# EAGLE design MinieasySens-RFM_V03-Build004 (EAGLE 9.3.0)
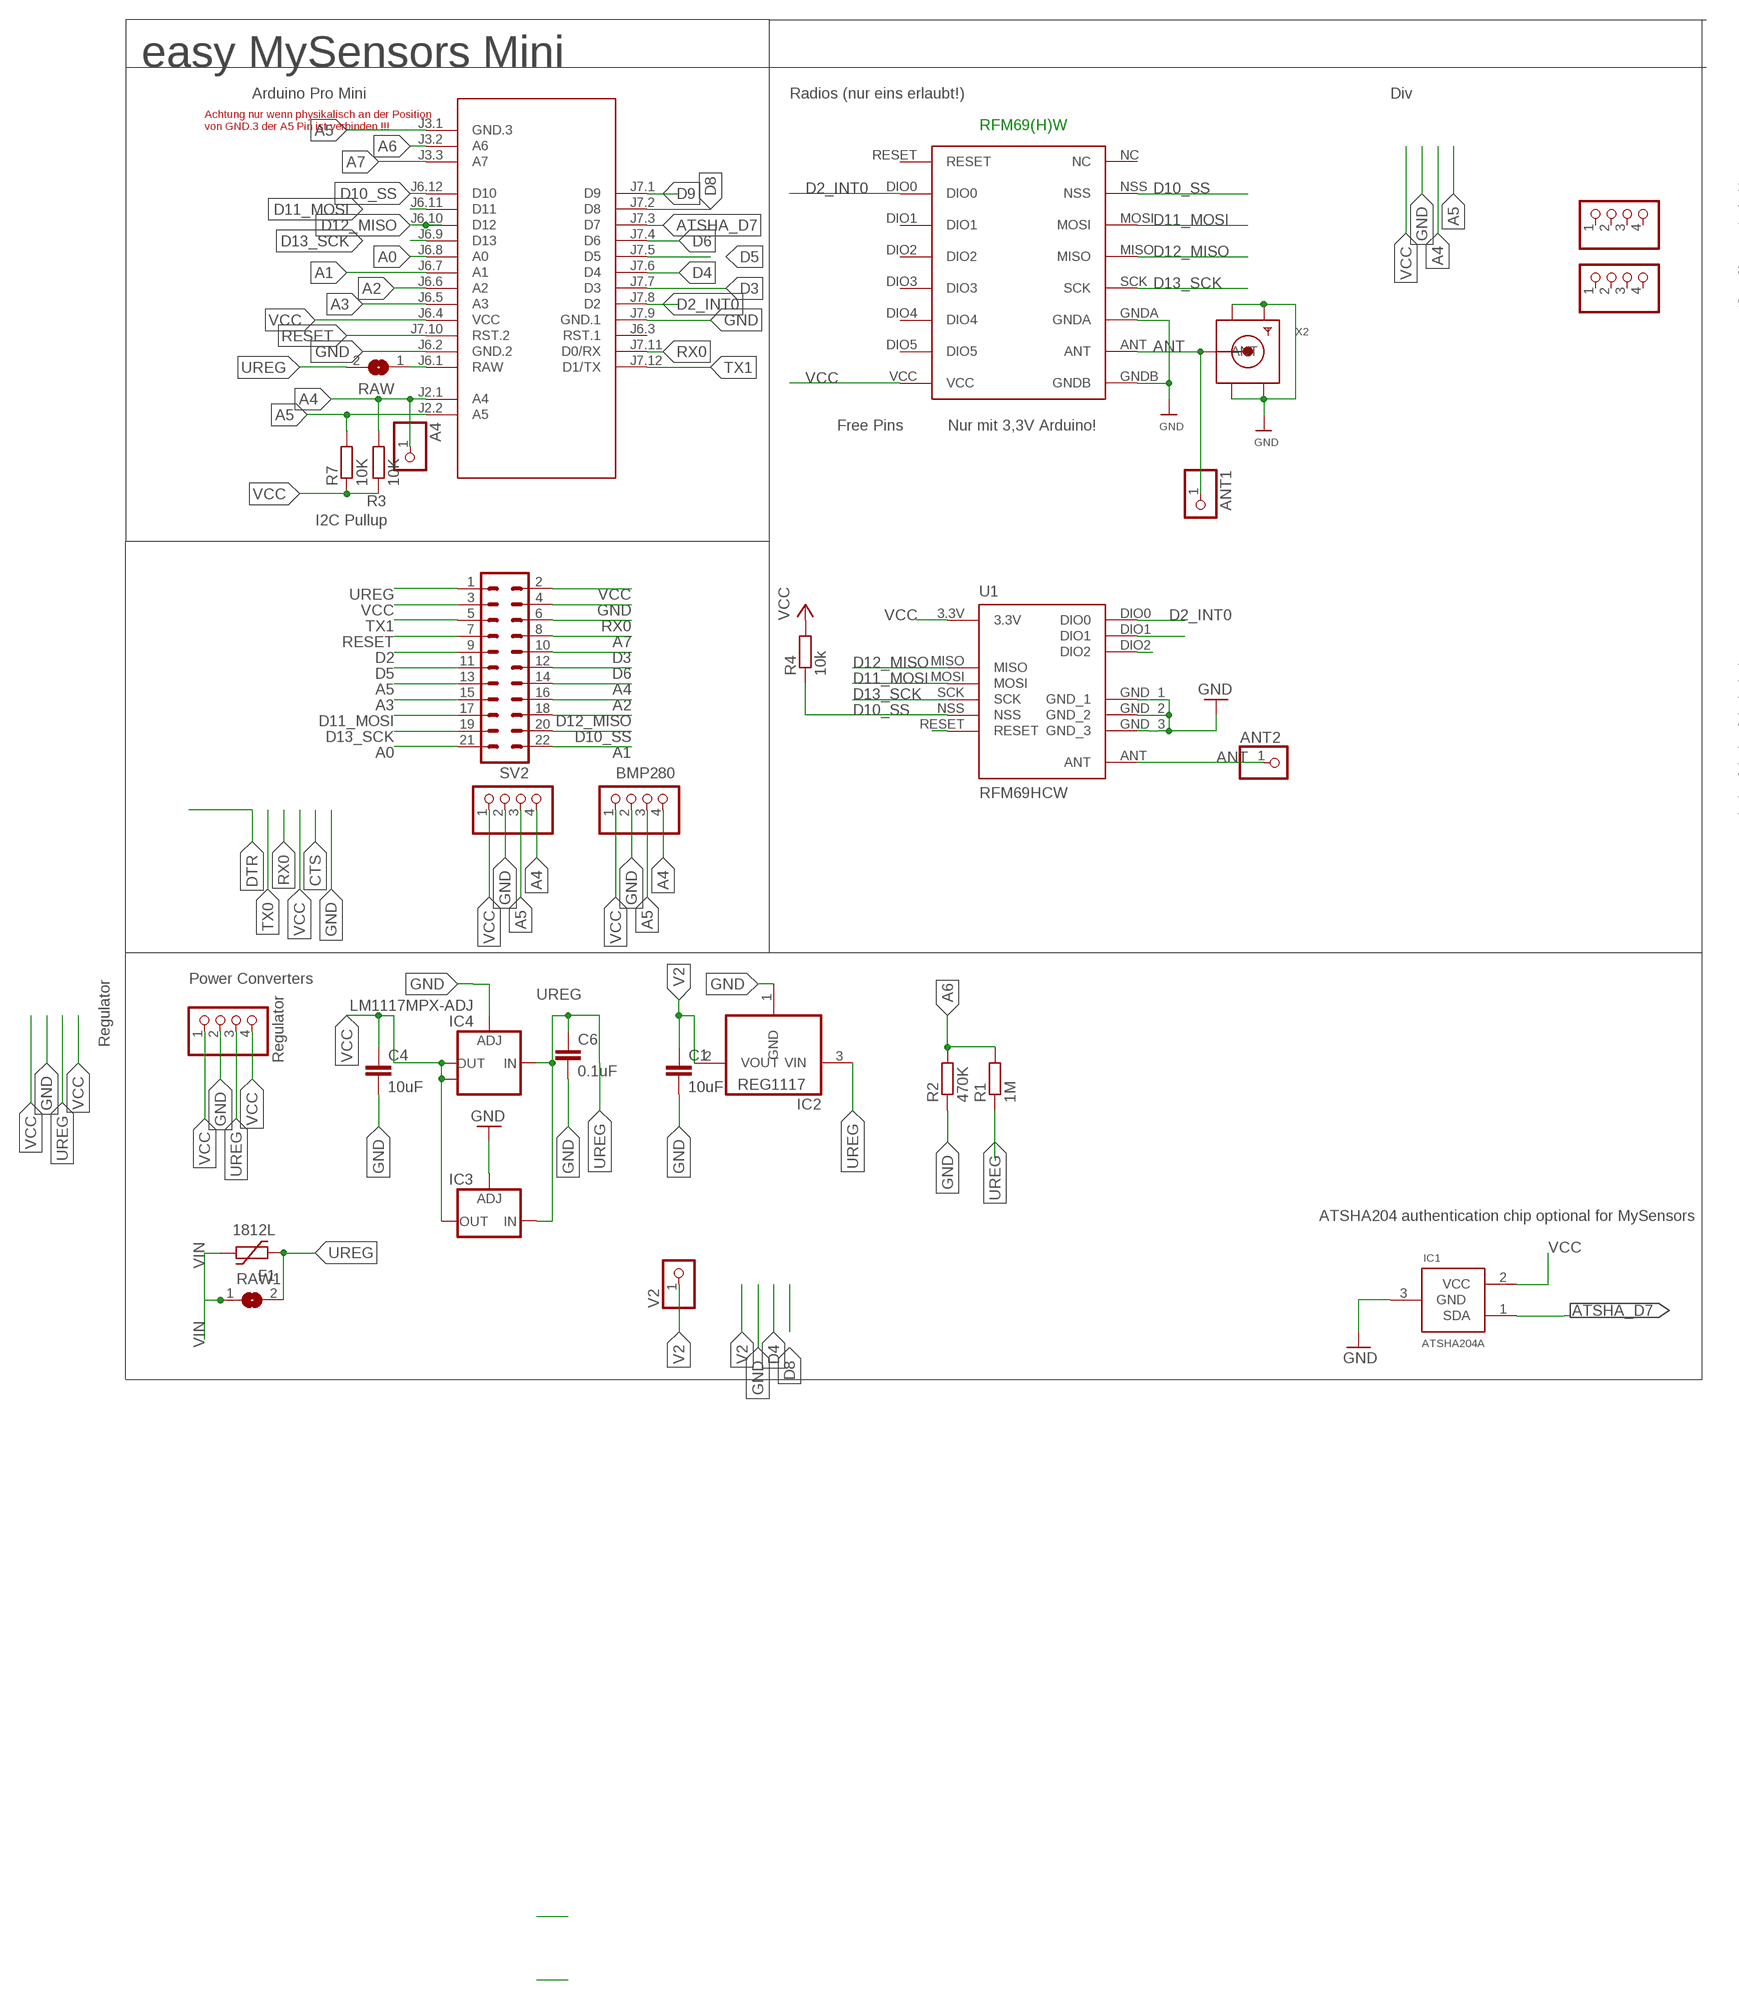
[diagram p0: schematic, sheet 1, part 1 of 2]
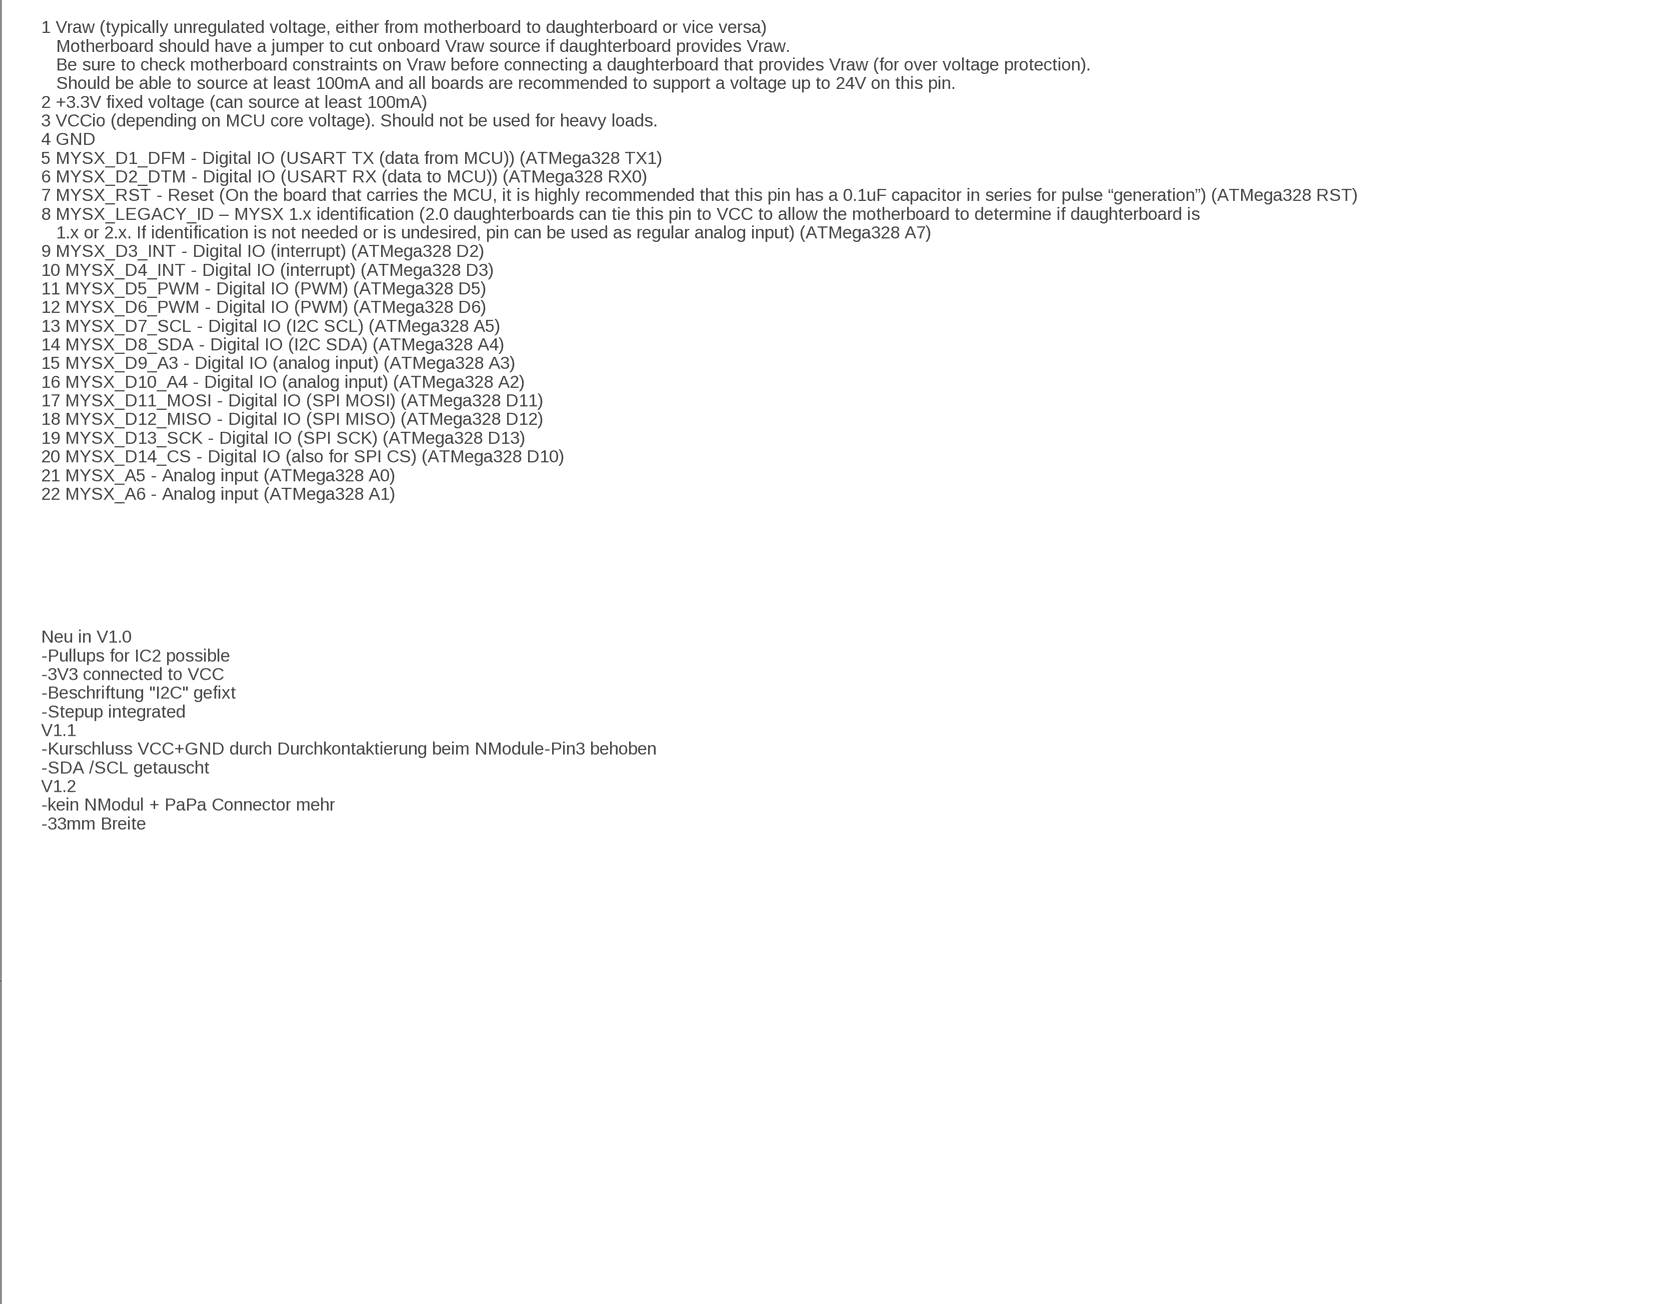
[diagram p1: schematic, sheet 1, part 2 of 2]

## Parts
A4  PINHD-1X1  [1X01]
ANT1  PINHD-1X1  [1X01]
ANT2  PINHD-1X1  [1X01]
BH1750  PINHD-1X04_2.54-S  [1X04-S]
C1  10uF  C-EUC1210  [C1210]
C4  10uF  C-EUC1210  [C1210]
C6  0.1uF  C-EUC1206  [C1206]
F1  1812L  [1812L]
I2C-1  PINHD-1X04_2.54-S  [1X04-S]
IC1  ATSHA204A  [SOT23]
IC2  REG1117  [SOT223]
IC3  LD117ADT50TR  [DPACK]
IC4  LM1117MPX-ADJ  [SOT223]
JP1  PINHD-1X04_2.54-S  [1X04-S]
JP2  PINHD-1X04_2.54-S  [1X04-S]
M1  ARDUINO-PRO-MINI-3.3V#NP  [ARDUINO-PRO-MINI#NP]
R1  1M  R-EU_R0805  [R0805]
R2  470K  R-EU_R0805  [R0805]
R3  10K  R-EU_R0805  [R0805]
R4  10k  R-EU_M0805  [M0805]
R7  10K  R-EU_R0805  [R0805]
RAW  SJ  [SJ]
RAW1  SJ  [SJ]
RFM69W  RFM69HW  [RFM]
STEPDWN  PINHD-1X04_2.54-S  [1X04-S]
SV2  MA11-2  [MA11-2]
U1  RFM69HCW  [RFM69HCW-XXXS2]
V2  PINHD-1X1  [1X01]
X2  SMACONNECTOR_EDGE  [SMA_EDGELAUNCH]

## Nets
A0: M1.J6.8(A0) SV2.21
A1: M1.J6.7(A1) SV2.22
A2: M1.J6.6(A2) SV2.16
A3: M1.J6.5(A3) SV2.15
A4: A4.1 BH1750.4 I2C-1.4 M1.J2.1(A4) R3.2 SV2.14
A5: BH1750.3 I2C-1.3 M1.J2.2(A5) M1.J3.1(GND.3) R7.2 SV2.13
A6: M1.J3.2(A6) R1.2 R2.2
A7: M1.J3.3(A7) SV2.8
ANT: ANT1.1 ANT2.1 RFM69W.ANT U1.ANT X2.P(ANT)
ATSHA_D7: IC1.1(SDA) M1.J7.3(D7)
D2: SV2.9
D2_INT0: M1.J7.8(D2) RFM69W.DIO0 U1.DIO0
D3: M1.J7.7(D3) SV2.10
D4: M1.J7.6(D4)
D5: M1.J7.5(D5) SV2.11
D6: M1.J7.4(D6) SV2.12
D8: M1.J7.2(D8)
D9: M1.J7.1(D9)
D10_SS: M1.J6.12(D10) R4.1 RFM69W.NSS SV2.20 U1.NSS
D11_MOSI: M1.J6.11(D11) RFM69W.MOSI SV2.17 U1.MOSI
D12_MISO: M1.J6.10(D12) RFM69W.MISO SV2.18 U1.MISO
D13_SCK: M1.J6.9(D13) RFM69W.SCK SV2.19 U1.SCK
GND [PWR]: BH1750.2 C1.2 C4.2 C6.2 I2C-1.2 IC1.3(GND) IC2.1(GND) IC3.1(ADJ) IC4.1(ADJ) M1.J6.2(GND.2) M1.J7.9(GND.1) R2.1 RFM69W.GNDA RFM69W.GNDB STEPDWN.2 SV2.4 U1.GND_1 U1.GND_2 U1.GND_3 X2.GND@1(GND4) X2.GND@2(GND3) X2.GND@3(GND2) X2.GND@4(GND1)
N$3: U1.RESET
N$14: U1.DIO2
N$15: U1.DIO1
RAW [PWR]: M1.J6.1(RAW) RAW.1
RESET: M1.J7.10(RST.2) SV2.7
RX0: M1.J7.11(D0/RX) SV2.6
TX1: M1.J7.12(D1/TX) SV2.5
UREG [PWR]: C6.1 F1.P$1 IC2.3(VIN) IC3.3(IN) IC4.3(IN) R1.1 RAW1.2 RAW.2 STEPDWN.3 SV2.1
V2 [PWR]: C1.1 IC2.2(VOUT) V2.1
VCC [PWR]: BH1750.1 C4.1 I2C-1.1 IC1.2(VCC) IC3.4(OUT) IC4.2(OUT) IC4.TAB(OUT1) M1.J6.4(VCC) R3.1 R4.2 R7.1 RFM69W.VCC STEPDWN.1 STEPDWN.4 SV2.2 SV2.3 U1.3.3V
VIN [PWR]: F1.P$2 RAW1.1
Unconnected: JP1.1 JP1.2 JP1.3 JP1.4 JP2.1 JP2.2 JP2.3 JP2.4 M1.J6.3(RST.1) RFM69W.DIO1 RFM69W.DIO2 RFM69W.DIO3 RFM69W.DIO4 RFM69W.DIO5 RFM69W.NC RFM69W.RESET

## Notes on the sheet
- easy MySensors Mini
- Arduino Pro Mini | Radios (nur eins erlaubt!) | Div
- Achtung nur wenn physikalisch an der Position 
  von GND.3 der A5 Pin ist verbinden !!!
- RFM69(H)W
- Free Pins | Nur mit 3,3V Arduino!
- I2C Pullup
- 1 Vraw (typically unregulated voltage, either from motherboard to daughterboard or vice versa)
     Motherboard should have a jumper to cut onboard Vraw source if daughterboard provides Vraw. 
     Be sure to check motherboard constraints on Vraw before connecting a daughterboard that provides Vraw (for over voltage protection). 
     Should be able to source at least 100mA and all boards are recommended to support a voltage up to 24V on this pin.
  2 +3.3V fixed voltage (can source at least 100mA)
  3 VCCio (depending on MCU core voltage). Should not be used for heavy loads.
  4 GND
  5 MYSX_D1_DFM - Digital IO (USART TX (data from MCU)) (ATMega328 TX1)
  6 MYSX_D2_DTM - Digital IO (USART RX (data to MCU)) (ATMega328 RX0)
  7 MYSX_RST - Reset (On the board that carries the MCU, it is highly recommended that this pin has a 0.1uF capacitor in series for pulse “generation”) (ATMega328 RST)
  8 MYSX_LEGACY_ID – MYSX 1.x identification (2.0 daughterboards can tie this pin to VCC to allow the motherboard to determine if daughterboard is 
     1.x or 2.x. If identification is not needed or is undesired, pin can be used as regular analog input) (ATMega328 A7)
  9 MYSX_D3_INT - Digital IO (interrupt) (ATMega328 D2)
  10 MYSX_D4_INT - Digital IO (interrupt) (ATMega328 D3)
  11 MYSX_D5_PWM - Digital IO (PWM) (ATMega328 D5)
  12 MYSX_D6_PWM - Digital IO (PWM) (ATMega328 D6)
  13 MYSX_D7_SCL - Digital IO (I2C SCL) (ATMega328 A5)
  14 MYSX_D8_SDA - Digital IO (I2C SDA) (ATMega328 A4)
  15 MYSX_D9_A3 - Digital IO (analog input) (ATMega328 A3)
  16 MYSX_D10_A4 - Digital IO (analog input) (ATMega328 A2)
  17 MYSX_D11_MOSI - Digital IO (SPI MOSI) (ATMega328 D11)
  18 MYSX_D12_MISO - Digital IO (SPI MISO) (ATMega328 D12)
  19 MYSX_D13_SCK - Digital IO (SPI SCK) (ATMega328 D13)
  20 MYSX_D14_CS - Digital IO (also for SPI CS) (ATMega328 D10)
  21 MYSX_A5 - Analog input (ATMega328 A0)
  22 MYSX_A6 - Analog input (ATMega328 A1)
- BMP280
- Neu in V1.0
  -Pullups for IC2 possible
  -3V3 connected to VCC
  -Beschriftung "I2C" gefixt
  -Stepup integrated
  V1.1
  -Kurschluss VCC+GND durch Durchkontaktierung beim NModule-Pin3 behoben
  -SDA /SCL getauscht
  V1.2
  -kein NModul + PaPa Connector mehr
  -33mm Breite
- Power Converters
- Regulator
- Regulator
- ATSHA204 authentication chip optional for MySensors

## Library data of the parts
A4 ANT1 ANT2 V2 = pinhead:PINHD-1X1: PIN HEADER
BH1750 I2C-1 JP1 JP2 STEPDWN = pinhead-2:PINHD-1X04: PIN HEADER
C1 C4 C6 = rcl:C-EU: CAPACITOR, European symbol
F1 = ptc-littlefuse:1812L
IC1 = Sensor:ATSHA204A
IC2 = burr-brown:REG1117: 800mA and 1A Low Dropout (LDO) Positive Regulator 1.8V, 2.5V, 2.85V, 3.3V, 5V, and Adj; MPN: REG1117; OC_FARNELL: 1097566; OC_NEWARK: 14P6981
IC3 = v-reg:LD117A?*: Low drop fixed and adjustable positive voltage regulators 1 A Source: http://www.st.com/stonline/products/literature/ds/7194/ld1117axx.pdf
IC4 = lm1117:LM1117MPX-ADJ
M1 = diy-modules:ARDUINO-PRO-MINI-*#NP: Arduino Pro Mini without programming pads
R1-R4 R7 = rcl:R-EU_: RESISTOR, European symbol
RAW RAW1 = jumper:SJ: SMD solder JUMPER
RFM69W = hoperf:RFM69HW
SV2 = con-Pinheader:MA11-2: PIN HEADER; OC_FARNELL: unknown; OC_NEWARK: unknown
U1 = doug:RFM69H
X2 = adafruit:SMACONNECTOR: SMA Connector 90° DIP SMA Connector, 50 Ohm (4UConnector: 07259)

## Net classes
0 default: width 0.254 mm, clearance 0.205 mm
1 PWR: width 0.406 mm, clearance 0.205 mm to class 0, clearance 0.205 mm

## Board
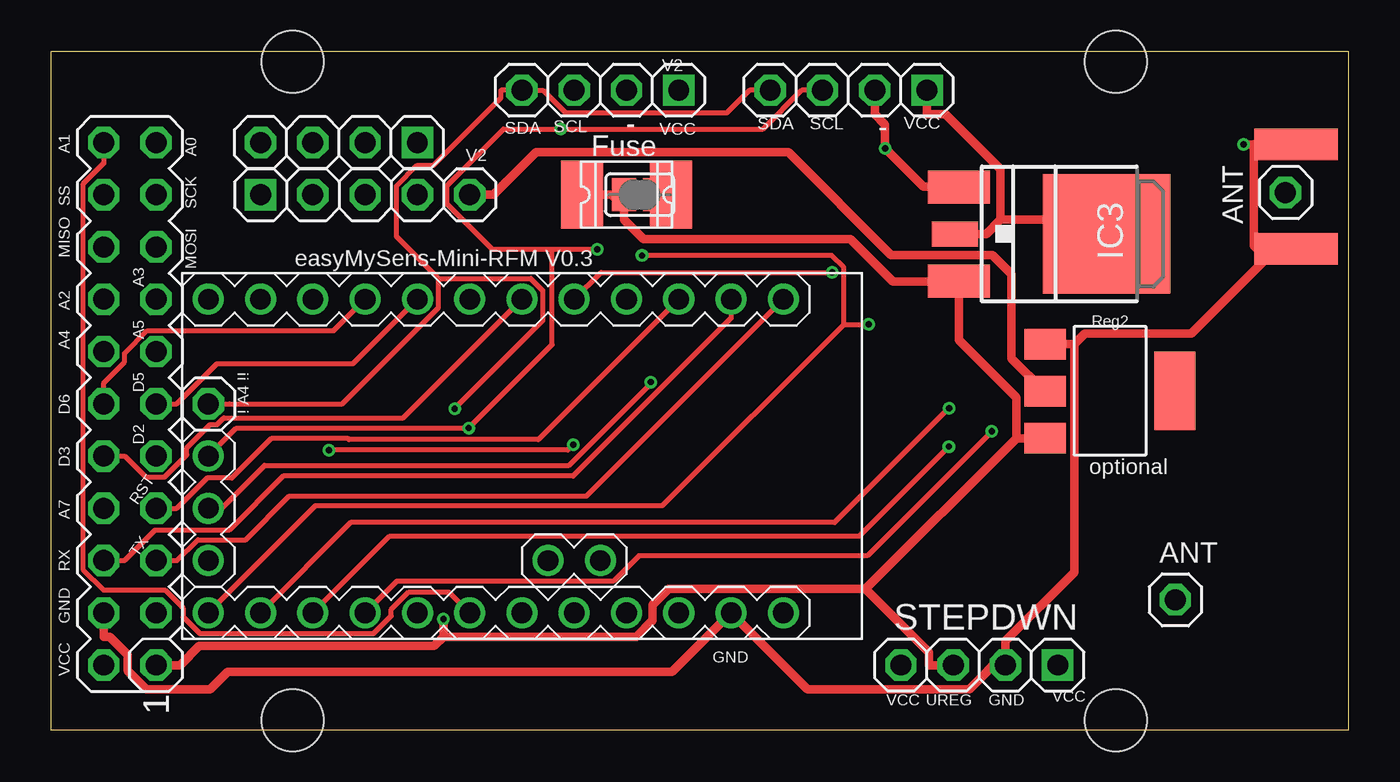
[diagram p2: board, top side]
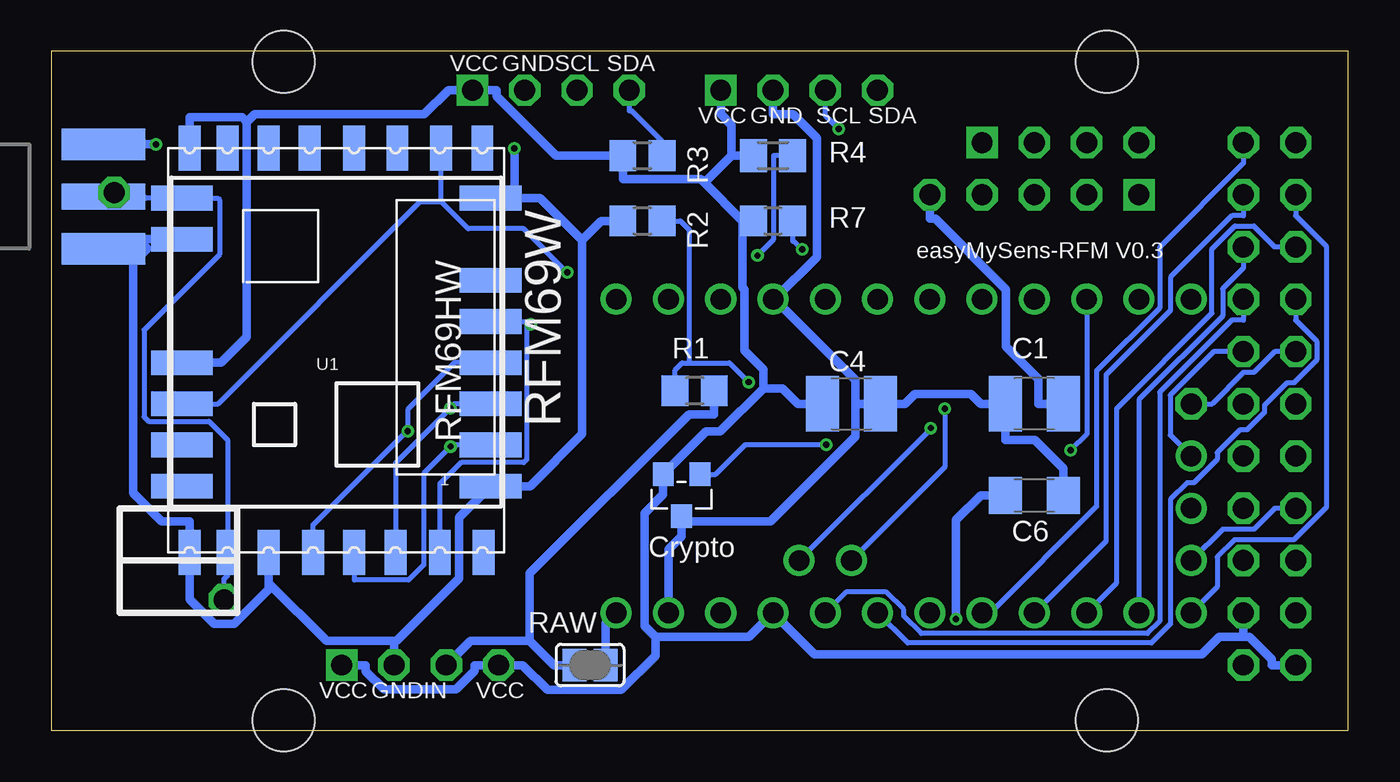
[diagram p3: board, bottom side, seen from below]

Size 63 x 33 mm. Coordinates in mm from the lower left corner, seen from the top.
Outline: 63,0 0,0 0,33 63,33 63,0
Copper layers (1*16): Top 0.035mm / dielectric 1.5mm / Bottom 0.035mm
Design rules "dirt_cheap_dirty_boards.v1": minimum track width 5mil, minimum drill 12mil, track to track 5mil, track to pad 5mil, pad to pad 5mil, via to via 5mil, smd to smd 0mil, copper to edge 10mil, drill to drill 10mil, minimum pad ring 10mil, minimum via ring 6mil, stop-mask expansion 2mil, vias tented up to drill 25mil, thermal gap 10mil
Holes 3 mm at 11.72,32.5 11.72,0.5 51.72,32.5 51.72,0.5
tRestrict: area 3.8,32.4 to 62.9,33; area 4.4,0 to 62.9,1.3
bRestrict: area 3.8,32.4 to 62.9,33; area 4.4,0 to 62.9,1.3

### Footprints (pad centres in the part's own frame; a part is rotated, then mirrored left to right if it is on the bottom)
1X01 = drill 1.016 octagon: 1 0,0
1X04-S = drill 1.016 square: 1 -3.81,0 | drill 1.016 octagon: 2 -1.27,0; 3 1.27,0; 4 3.81,0
C1210 = smd 1.6 x 2.7: 1 -1.4,0; 2 1.4,0
C1206 = smd 1.6 x 1.8: 1 -1.4,0; 2 1.4,0
1812L = smd 2.03 x 3.3: P$1 -2.16,0; P$2 2.16,0
SOT23 = smd 1.016 x 1.143: 1 -0.889,-1.016; 2 0.889,-1.016; 3 0,1.016
SOT223 = smd 1.499 x 2.007: 1 -2.261,-3.15; 2 0.025,-3.15; 3 2.311,-3.15 | smd 3.81 x 2.007: 4 0,3.15
DPACK = smd 1.6 x 3: 1 -2.28,-4.8; 3 2.28,-4.8 | smd 5.8 x 6.2: 4 0,2.38
SOT223' = smd 1.219 x 2.235: 1 -2.311,-3.099; 2 0,-3.099; 3 2.311,-3.099 | smd 3.6 x 2.2: TAB 0,3.099
ARDUINO-PRO-MINI#NP = drill 1: J2.1 -1.27,5.08; J2.2 -3.81,5.08; J3.1 15.24,0; J3.2 15.24,2.54; J3.3 15.24,5.08; J6.1 -12.7,7.62; J6.2 -10.16,7.62; J6.3 -7.62,7.62; J6.4 -5.08,7.62; J6.5 -2.54,7.62; J6.6 0,7.62; J6.7 2.54,7.62; J6.8 5.08,7.62; J6.9 7.62,7.62; J6.10 10.16,7.62; J6.11 12.7,7.62; J6.12 15.24,7.62; J7.1 15.24,-7.62; J7.2 12.7,-7.62; J7.3 10.16,-7.62; J7.4 7.62,-7.62; J7.5 5.08,-7.62; J7.6 2.54,-7.62; J7.7 0,-7.62; J7.8 -2.54,-7.62; J7.9 -5.08,-7.62; J7.10 -7.62,-7.62; J7.11 -10.16,-7.62; J7.12 -12.7,-7.62
R0805 = smd 1.3 x 1.5: 1 -0.95,0; 2 0.95,0
M0805 = smd 1.3 x 1.6: 1 -0.95,0; 2 0.95,0
SJ = smd 1.168 x 1.6: 1 -0.762,0; 2 0.762,0
RFM = smd 2.184 x 1.067: ANT 19.651,2.889; DIO0 0,13.27; DIO1 0,11.143; DIO2 0,9.047; DIO3 0,6.889; DIO4 0,4.889; DIO5 0,2.889; GNDA 19.651,4.889; GNDB 19.651,1.048; MISO 19.651,9.047; MOSI 19.651,11.047; NC 19.651,15.334; NSS 19.651,13.206; RESET 0,15.27; SCK 19.651,7.048; VCC 0,1.048
MA11-2 = drill 1.016 octagon: 1 -12.7,-1.27; 2 -12.7,1.27; 3 -10.16,-1.27; 4 -10.16,1.27; 5 -7.62,-1.27; 6 -7.62,1.27; 7 -5.08,-1.27; 8 -5.08,1.27; 9 -2.54,-1.27; 10 -2.54,1.27; 11 0,-1.27; 12 0,1.27; 13 2.54,-1.27; 14 2.54,1.27; 15 5.08,-1.27; 16 5.08,1.27; 17 7.62,-1.27; 18 7.62,1.27; 19 10.16,-1.27; 20 10.16,1.27; 21 12.7,-1.27; 22 12.7,1.27
RFM69HCW-XXXS2 = smd 3 x 1.2: 3.3V 7.5,1; ANT 7.5,-7; DIO0 7.5,3; DIO1 7.5,5; DIO2 7.5,7; GND_1 7.5,-5; GND_2 -7.5,-7; GND_3 -7.5,7; MISO -7.5,5; MOSI -7.5,3; NSS -7.5,-1; RESET -7.5,-3; SCK -7.5,1
SMA_EDGELAUNCH = smd 4.064 x 1.524: GND@1 2.032,-2.54; GND@2 2.032,2.54 | smd 4.064 x 1.524 bottom: GND@3 2.032,2.54; GND@4 2.032,-2.54 | smd 4.064 x 1.27: P 2.032,0

### Placement (x,y rotation side)
A4  7.62,15.88 90 top
ANT1  59.96,26.14 0 top
ANT2  54.61,6.35 0 top
BH1750  38.73,31.11 180 top
C1  15.24,15.88 180 bottom
C4  24.13,15.88 0 bottom
C6  15.24,11.43 0 bottom
F1  27.94,26.04 0 top
I2C-1  26.67,31.11 180 top
IC1  32.38,11.43 180 bottom
IC2  51.44,16.51 270 top
IC3  48.9,24.13 270 top
IC4  LM1117MPX-ADJ  [SOT223']  46.99,24.13 270 top
JP1  13.97,26.04 0 top
JP2  13.97,28.57 180 top
M1  22.86,13.34 180 top
R1  31.75,16.51 180 bottom
R2  34.29,24.77 0 bottom
R3  34.29,27.94 0 bottom
R4  27.94,27.94 180 bottom
R7  27.94,24.77 0 bottom
RAW  36.83,3.17 180 bottom
RAW1  28.57,26.04 180 top
RFM69W  57.34,28.3 270 bottom
STEPDWN  45.09,3.17 180 top
SV2  3.81,15.88 90 top
U1  49.16,18.87 180 bottom
V2  20.32,26.04 0 top
X2  62.5,25.95 0 bottom

### Tracks (layer width: path | path; a pad name or v marks a point on that pad's centre or on a via)
A0
  Bottom 0.254: SV2.21 5.08,27.56 9.15,23.49 9.15,20.54 12.22,17.47 12.22,10.88 17.39,5.71 M1.J6.8
A1
  Top 0.254: SV2.22 2.54,27.56 1.52,26.54 1.52,7.83 2.53,6.82 5.53,6.82 6.39,5.95 6.39,5.51 7.2,4.71 15.66,4.71 16.51,5.56 16.51,5.87 17.36,6.73 19.31,6.73 M1.J6.7
A2
  Bottom 0.254: SV2.16 2.54,19.94 1.52,18.92 1.52,17.99 2.63,16.89 2.97,16.89 4.06,15.79 4.06,15.45 4.91,14.61 5.25,14.61 6.35,13.5 6.35,13.17 7.49,12.04 7.81,12.04 8.63,11.22 8.63,5.17 9.55,4.25 21.39,4.25 M1.J6.6
A3
  Bottom 0.254: M1.J6.5 24.39,6.73 22.44,6.73 21.59,5.88 21.59,5.56 20.74,4.71 9.74,4.71 9.15,5.3 9.15,16.44 5.65,19.94 5.08,19.94 SV2.15
A4  (via drill 0.3 pad 0.61)
  Top 0.254: 18.8,21.96 16.76,24.01 16.76,26.46 17.77,27.47 18.57,27.47 21.84,30.75 21.84,31.11 I2C-1.4 23.88,31.11 24.97,30.02 32.81,30.02 33.91,31.11 BH1750.4 | 18.8,21.96 18.8,20.55 14.13,15.88 8.64,15.88 A4.1 | 18.8,21.96 23.28,21.96 23.87,21.38 23.87,19.92 v19.59,15.64
  Bottom 0.254: v19.59,15.64 19.59,12.79 M1.J2.1 | A4.1 6.6,15.88 5.08,17.4 4.57,17.4 3.56,18.41 SV2.14 | BH1750.4 34.92,30.1 34.79,30.1 33.34,28.65 R3.2
A5  (via drill 0.3 pad 0.61)
  Top 0.254: 24.33,23.38 24.33,18.75 v20.27,14.7 8.98,14.7 M1.J3.1 | 24.33,23.38 21.43,23.38 19.22,25.58 19.22,26.49 21.96,29.23 v24.75,29.23 34.56,29.23 36.45,31.11 BH1750.3 | v26.52,23.38 24.33,23.38
  Bottom 0.254: M1.J2.2 20.27,14.65 v20.27,14.7 | SV2.13 6.52,18.41 8.64,16.3 8.64,14.35 M1.J3.1 | R7.2 26.99,23.76 26.91,23.76 v26.52,23.38 | v24.75,29.23 25.4,29.88 I2C-1.3
A6  (via drill 0.3 pad 0.61)
  Top 0.254: M1.J3.2 8.27,10.79 10.36,12.88 25.14,12.88 29.13,16.87 v29.13,16.93
  Bottom 0.254: 32.01,17.86 30.06,17.86 v29.13,16.93 | 32.01,17.86 32.36,17.86 32.7,17.51 R1.2 | 32.01,17.86 32.01,24.34 32.44,24.77 R2.2
A7
  Bottom 0.254: SV2.8 3.56,10.79 4.57,9.78 6.1,9.78 M1.J3.3
ANT
  Bottom 0.254: ANT2.1 54.61,7.37 54.45,7.53 RFM69W.ANT 54.45,14.12 55.34,15.02 58.27,15.02 58.5,15.24 58.5,19.46 54.83,23.13 54.83,25.79 54.91,25.87 U1.ANT 57.54,25.87 58.42,25.87 58.64,26.09 59.96,26.09 | X2.P 60.1,25.95 59.96,26.09 | 59.96,26.09 ANT1.1
ATSHA_D7  (via drill 0.3 pad 0.61)
  Top 0.254: v25.35,13.88 25.09,13.62 v13.48,13.62
  Bottom 0.254: M1.J7.3 12.7,14.39 v13.48,13.62 | IC1.1 30.73,12.45 29.3,13.88 v25.35,13.88
D2_INT0  (via drill 0.3 pad 0.61)
  Top 0.254: M1.J7.8 26.71,22.26 v37.94,22.26
  Bottom 0.254: 44.06,25.7 RFM69W.DIO0 | v37.94,22.26 40.06,24.38 42.75,24.38 44.06,25.7 | 44.06,25.7 45.09,25.7 54.91,15.87 U1.DIO0
D3
  Top 0.254: M1.J7.7 17.09,15.19 8.37,15.19 8.04,14.86 7.71,14.86 6.57,13.72 6.57,13.39 5.5,12.31 4.58,12.31 3.56,13.34 SV2.10
D5
  Top 0.254: M1.J7.5 14.63,17.81 8.03,17.81 6.1,15.88 SV2.11
D6
  Top 0.254: SV2.12 2.54,16.89 3.56,17.91 3.56,18.33 4.66,19.43 13.72,19.43 M1.J7.4
D10_SS  (via drill 0.3 pad 0.61)
  Top 0.254: 38.5,19.74 v39.71,19.74 | 38.5,19.74 38.5,22.5 37.91,23.08 v28.7,23.08 | M1.J6.12 12.83,10.93 29.69,10.93 38.5,19.74
  Bottom 0.254: 39.91,19.74 v39.71,19.74 | 39.91,19.74 39.91,13.16 40.05,13.02 43.09,13.02 44.13,11.98 RFM69W.NSS | 39.91,19.74 39.91,19.87 U1.NSS | M1.J6.12 6.35,6.98 6.35,8.42 5.5,9.27 2.63,9.27 1.06,10.83 1.06,23.54 2.54,25.02 SV2.20 | v28.7,23.08 27.89,23.88 27.89,27.94 R4.1
D11_MOSI  (via drill 0.3 pad 0.61)
  Top 0.254: v43.61,15.66 38.05,10.1 14.54,10.1 | 14.54,10.1 | 14.54,10.1 M1.J6.11
  Bottom 0.254: SV2.17 5.08,22.48 6.1,21.46 6.1,20.14 10.16,16.08 M1.J6.11 | RFM69W.MOSI 46.29,12.99 v43.61,15.66 43.42,15.86 43.42,15.87 U1.MOSI
D12_MISO  (via drill 0.3 pad 0.61)
  Top 0.254: M1.J6.10 16.43,9.45 39.26,9.45 v43.61,13.8
  Bottom 0.254: U1.MISO 43.42,13.87 43.49,13.8 v43.61,13.8 44.92,12.49 44.92,8.04 45.65,7.31 48.29,7.31 RFM69W.MISO | M1.J6.10 11.24,7.17 11.24,15.64 6.61,20.27 6.61,23.4 5.5,24.52 4.58,24.52 3.56,23.5 SV2.18
D13_SCK  (via drill 0.3 pad 0.61)
  Top 0.254: v45.69,14.54 39.64,8.49 28.54,8.49 27.3,7.25 16.77,7.25 M1.J6.9
  Bottom 0.254: M1.J6.9 11.76,9.2 11.76,17.28 8.63,20.41 8.63,22.03 5.64,25.02 5.08,25.02 SV2.19 | U1.SCK 43.42,17.87 45.69,15.6 v45.69,14.54 45.75,14.54 50.29,10 RFM69W.SCK
GND  (via drill 0.3 pad 0.61)
  Top 0.406: 46.35,3.76 44.59,2 36.73,2 M1.J6.2 30.14,2.84 8.55,2.84 7.71,2 4.6,2 3.71,2.89 3.71,3.67 2.83,4.54 2.54,4.54 SV2.4 | 46.35,3.76 46.35,4.34 49.7,7.69 49.7,18.77 | STEPDWN.2 46.35,3.76 | 59.52,23.41 55.39,19.28 50.21,19.28 49.7,18.77 | 59.52,23.41 58.56,23.41 58.42,23.55 58.42,28.48 | X2.GND@1 59.52,23.41 | IC3.1 44.06,26.44 IC4.1 42.37,26.44 40.52,28.29 v40.51,28.29 40.51,29.44 40.01,29.95 BH1750.2 | 58.42,28.48 v57.92,28.48 | 58.42,28.48 58.43,28.49 X2.GND@2 | IC2.1 49.7,18.77
  Bottom 0.406: 23.94,15.88 23.94,14.29 28.06,10.17 32.38,10.17 | 32.38,10.17 32.38,9.43 33.02,8.8 M1.J6.2 | IC1.3 32.38,10.17 | 40.51,25.87 39.25,25.87 37.22,23.84 | 40.51,25.87 40.59,25.87 U1.GND_2 | 40.51,25.87 v40.51,28.29 | 37.22,23.84 36.3,24.77 R2.1 | 37.22,23.84 37.22,14.4 39.76,11.87 U1.GND_3 43.19,10.35 43.19,7.38 46.23,4.34 46.35,4.34 | 58.34,23.41 58.57,23.64 58.57,23.87 U1.GND_1 | 58.34,23.41 59.03,22.72 59.03,11.55 57.64,10.15 56.29,10.15 RFM69W.GNDB 56.29,6.37 55.1,5.18 54.13,5.18 52.45,6.86 52.45,7.15 | X2.GND@1 58.34,23.41 | RFM69W.GNDA 52.45,7.15 | 46.35,4.34 49.64,4.34 52.45,7.15 | 46.35,4.34 46.35,4.19 STEPDWN.2 | I2C-1.2 27.94,29.95 26.96,29.95 25.8,28.79 25.8,23.01 27.86,20.95 | 27.86,20.95 M1.J7.9 | 23.94,15.88 23.94,17.04 27.86,20.95 | 23.94,15.88 C4.2 21.52,15.88 21.05,16.35 18.32,16.35 17.85,15.88 C1.2 16.64,14.12 15.22,14.12 13.84,12.74 C6.2 | v57.92,28.48 57.94,28.49 58.03,28.49 X2.GND@2
RAW
  Bottom 0.406: RAW.1 36.07,5.21 M1.J6.1
RESET
  Top 0.254: M1.J7.10 23.66,14.14 14.46,14.14 14.42,14.18 10.68,14.18 8.77,12.27 7.57,12.27 6.1,10.79 SV2.7
RX0
  Top 0.254: M1.J7.11 33.02,20.03 25.35,12.36 11.26,12.36 8.63,9.72 5.03,9.72 3.56,8.26 SV2.6
TX1
  Top 0.254: SV2.5 6.1,8.26 7.11,9.27 9.44,9.27 11.56,11.38 25.99,11.38 M1.J7.12
UREG  (via drill 0.3 pad 0.61)
  Top 0.406: 39.55,6.88 46.87,14.2 | 19.05,4.55 28.42,4.55 29.21,5.34 29.21,6.1 29.99,6.88 39.55,6.88 | 39.55,6.88 42.65,3.79 42.65,3.17 STEPDWN.3 | 19.05,4.55 v19.05,5.41 | 19.05,4.55 18.6,4.11 7.18,4.11 6.25,3.17 SV2.1 | F1.P$1 27.2,26.04 27.81,25.43 | 27.81,25.43 27.81,24.83 28.77,23.87 38.83,23.87 40.88,21.82 IC4.3 44.06,21.82 IC3.3 44.09,20.64 44.09,18.96 46.87,16.19 46.87,14.2 | RAW1.2 27.81,25.43 | IC2.3 46.87,14.2
  Bottom 0.406: C6.1 17.85,11.43 19.05,10.23 v19.05,5.41 | 39.76,4.35 38.58,3.17 RAW.2 | STEPDWN.3 42.64,4.35 39.76,4.35 | 39.76,4.35 39.76,7.62 32.03,15.35 30.8,15.35 R1.1
V2
  Top 0.406: IC2.2 48.24,16.48 46.64,18.08 46.64,22.19 45.72,23.11 40.79,23.11 35.8,28.09 23.55,28.09 21.49,26.04 V2.1
  Bottom 0.406: C1.1 15.05,15.88 15.05,17.08 16.62,18.65 16.62,21.44 20.05,24.86 20.32,24.86 V2.1
VCC
  Top 0.406: IC4.2 45.42,24.13 46.1,24.82 | 46.1,24.82 50.09,24.82 IC4.TAB IC3.4 | 46.1,24.82 46.1,27.28 43.44,29.95 42.55,29.95 BH1750.1
  Bottom 0.406: 33.66,4.55 33.66,3.62 35.31,1.97 38.9,1.97 40.1,3.17 STEPDWN.4 42.45,3.17 42.45,2.89 43.33,2 46.84,2 47.73,2.88 47.73,3.17 STEPDWN.1 | 33.66,4.55 34.19,5.08 34.19,10.55 33.27,11.47 IC1.2 31.19,14.53 30.5,14.53 28.41,16.62 | 33.66,4.55 29.1,4.55 M1.J6.4 25.93,3.71 7.1,3.71 6.26,4.54 5.08,4.54 | 31.27,26.62 29.41,24.77 | 31.27,26.62 31.43,26.78 35.24,26.78 R3.1 38.49,27.94 41.38,30.82 41.38,31.11 BH1750.1 43.72,31.11 44.88,29.95 53.13,29.95 53.5,29.57 | 31.27,26.62 29.95,27.94 | 29.41,24.77 R7.1 | 28.41,16.62 28.41,17.55 29.32,18.45 29.32,21.44 29.41,21.53 29.41,24.77 | 28.41,16.62 27.49,16.62 26.74,15.88 C4.1 | 53.5,29.57 53.74,29.8 56.29,29.8 RFM69W.VCC | 53.5,29.57 53.5,19.12 54.76,17.87 U1.3.3V | R4.2 29.95,27.94 | SV2.2 3.71,3.17 3.71,3.46 4.79,4.54 5.08,4.54 | SV2.3 5.08,4.54 | I2C-1.1 30.48,29.95 29.95,29.41 29.95,27.94
VIN
  Top 0.406: RAW1.1 F1.P$2

### Text on the board
tPlace: A0 | A1 | SCK | SS | ANT | MOSI | MISO | A3 | easyMySens-Mini-RFM V0.3 | A2 | A5 | Reg2 | A4 | D5 | ! A4 !! | D6 | D2 | D3 | optional | RST | A7 | RX | TX | ANT | GND | VCC | GND | VCC | UREG | GND | VCC
bPlace: easyMySens-RFM V0.3
tNames: V2 | SCL | - | VCC | - | VCC | SDA | Fuse | SDA | SCL | V2
bNames: SDA | SCL | GND | VCC | SDA | SCL | GND | VCC | R4 | R3 | R2 | R7 | C1 | R1 | C4 | C6 | Crypto | RAW | VCC | IN | GND | VCC
tValues: Gehäuse: RND 455‑00307